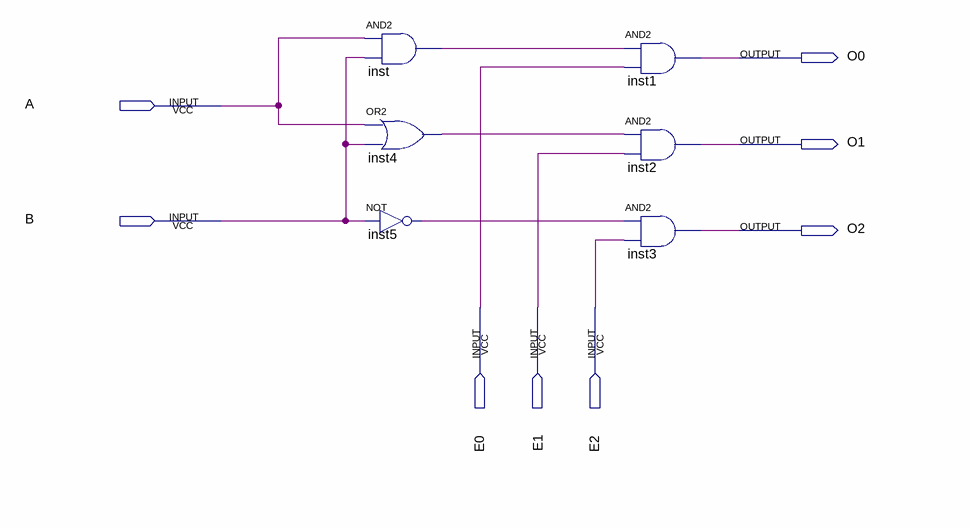
[diagram p0: schematic sheet]
// Quartus schematic logic_unit.bdf as structural Verilog: 6 symbols, 8 pins
module logic_unit (
  input  A,
  input  B,
  input  E0,
  input  E1,
  input  E2,
  output O0,
  output O1,
  output O2
);

  wire inst4_out, inst5_out, inst_out;

  and inst (inst_out, A, B);
  or inst4 (inst4_out, A, B);
  not inst5 (inst5_out, B);
  and inst1 (O0, inst_out, E0);
  and inst2 (O1, inst4_out, E1);
  and inst3 (O2, inst5_out, E2);
endmodule
